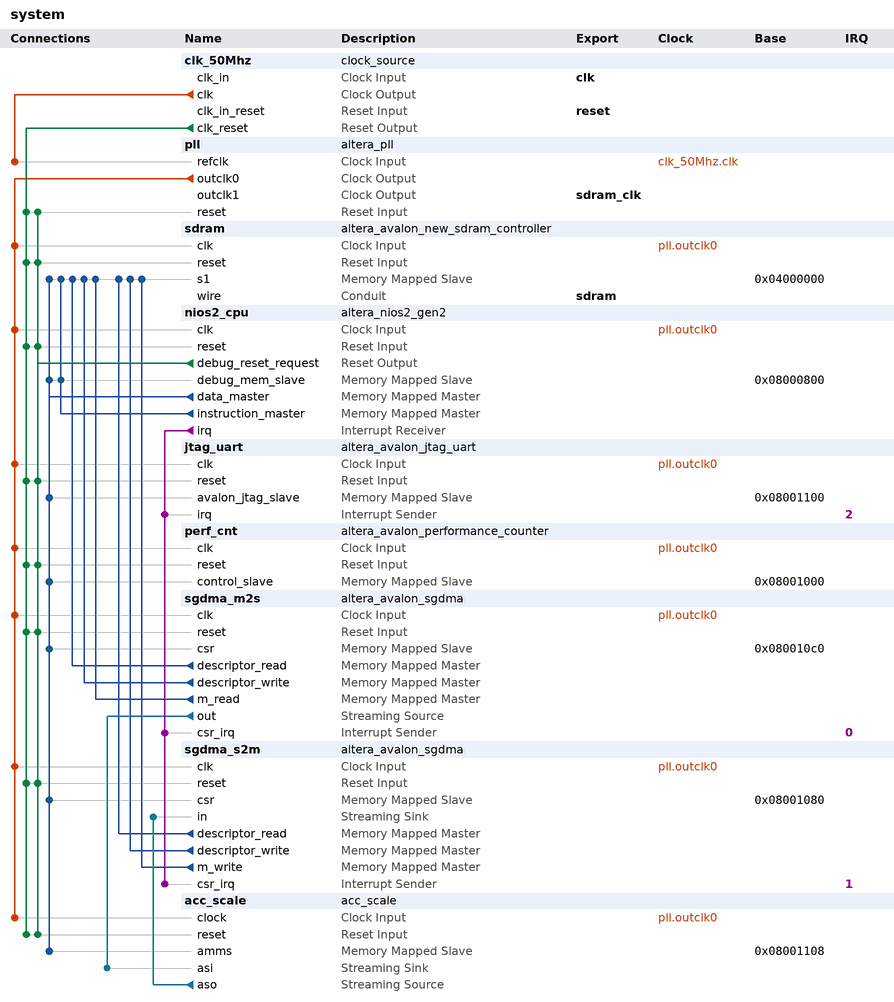
[diagram p0: system contents]
# Platform Designer (Qsys) system system, Cyclone V 5CSXFC6D6F31C6
# Parameters at their usual value, and those the tool derives, are not listed.
package require -exact qsys 18.1
create_system system
set_project_property DEVICE_FAMILY {Cyclone V}
set_project_property DEVICE 5CSXFC6D6F31C6

add_instance clk_50Mhz clock_source 18.1
set_instance_parameter_value clk_50Mhz clockFrequency 50000000

add_instance pll altera_pll 18.1
set_instance_parameter_value pll gui_device_speed_grade 1
set_instance_parameter_value pll gui_number_of_clocks 2
set_instance_parameter_value pll gui_operation_mode direct
set_instance_parameter_value pll gui_output_clock_frequency0 100.0
set_instance_parameter_value pll gui_output_clock_frequency1 100.0
set_instance_parameter_value pll gui_phase_shift1 -3000
set_instance_parameter_value pll gui_pll_mode {Integer-N PLL}
set_instance_parameter_value pll gui_reference_clock_frequency 50.0
set_instance_parameter_value pll gui_use_locked false

add_instance sdram altera_avalon_new_sdram_controller 18.1
set_instance_parameter_value sdram TAC 5.4
set_instance_parameter_value sdram TRCD 15.0
set_instance_parameter_value sdram TRFC 60.0
set_instance_parameter_value sdram TRP 15.0
set_instance_parameter_value sdram casLatency 2
set_instance_parameter_value sdram columnWidth 10
set_instance_parameter_value sdram dataWidth 16
set_instance_parameter_value sdram generateSimulationModel false
set_instance_parameter_value sdram initRefreshCommands 8
set_instance_parameter_value sdram model single_Micron_MT48LC4M32B2_7_chip
set_instance_parameter_value sdram numberOfBanks 4
set_instance_parameter_value sdram numberOfChipSelects 1
set_instance_parameter_value sdram powerUpDelay 100.0
set_instance_parameter_value sdram refreshPeriod 7.8125
set_instance_parameter_value sdram rowWidth 13

add_instance nios2_cpu altera_nios2_gen2 18.1
set_instance_parameter_value nios2_cpu dcache_size 2048
set_instance_parameter_value nios2_cpu exceptionSlave sdram.s1
set_instance_parameter_value nios2_cpu icache_size 4096
set_instance_parameter_value nios2_cpu impl Tiny
set_instance_parameter_value nios2_cpu resetSlave sdram.s1

add_instance jtag_uart altera_avalon_jtag_uart 18.1
set_instance_parameter_value jtag_uart simInteractiveOptions NO_INTERACTIVE_WINDOWS

add_instance perf_cnt altera_avalon_performance_counter 18.1
set_instance_parameter_value perf_cnt numberOfSections 7

add_instance sgdma_m2s altera_avalon_sgdma 18.1
set_instance_parameter_value sgdma_m2s enableBurstTransfers false
set_instance_parameter_value sgdma_m2s enableUnalignedTransfers false
set_instance_parameter_value sgdma_m2s readBlockDataWidth 8
set_instance_parameter_value sgdma_m2s sinkErrorWidth 0
set_instance_parameter_value sgdma_m2s sourceErrorWidth 0
set_instance_parameter_value sgdma_m2s transferMode MEMORY_TO_STREAM
set_instance_parameter_value sgdma_m2s writeBurstcountWidth 4

add_instance sgdma_s2m altera_avalon_sgdma 18.1
set_instance_parameter_value sgdma_s2m enableBurstTransfers false
set_instance_parameter_value sgdma_s2m enableUnalignedTransfers false
set_instance_parameter_value sgdma_s2m readBlockDataWidth 8
set_instance_parameter_value sgdma_s2m sinkErrorWidth 0
set_instance_parameter_value sgdma_s2m sourceErrorWidth 0
set_instance_parameter_value sgdma_s2m transferMode STREAM_TO_MEMORY
set_instance_parameter_value sgdma_s2m writeBurstcountWidth 4

add_instance acc_scale acc_scale 1.0
set_instance_parameter_value acc_scale max_width 1024

# connections
add_connection clk_50Mhz.clk pll.refclk clock
add_connection pll.outclk0 acc_scale.clock clock
add_connection pll.outclk0 jtag_uart.clk clock
add_connection pll.outclk0 nios2_cpu.clk clock
add_connection pll.outclk0 perf_cnt.clk clock
add_connection pll.outclk0 sdram.clk clock
add_connection pll.outclk0 sgdma_m2s.clk clock
add_connection pll.outclk0 sgdma_s2m.clk clock
add_connection clk_50Mhz.clk_reset acc_scale.reset reset
add_connection clk_50Mhz.clk_reset jtag_uart.reset reset
add_connection clk_50Mhz.clk_reset nios2_cpu.reset reset
add_connection clk_50Mhz.clk_reset perf_cnt.reset reset
add_connection clk_50Mhz.clk_reset pll.reset reset
add_connection clk_50Mhz.clk_reset sdram.reset reset
add_connection clk_50Mhz.clk_reset sgdma_m2s.reset reset
add_connection clk_50Mhz.clk_reset sgdma_s2m.reset reset
add_connection nios2_cpu.debug_reset_request acc_scale.reset reset
add_connection nios2_cpu.debug_reset_request jtag_uart.reset reset
add_connection nios2_cpu.debug_reset_request nios2_cpu.reset reset
add_connection nios2_cpu.debug_reset_request perf_cnt.reset reset
add_connection nios2_cpu.debug_reset_request pll.reset reset
add_connection nios2_cpu.debug_reset_request sdram.reset reset
add_connection nios2_cpu.debug_reset_request sgdma_m2s.reset reset
add_connection nios2_cpu.debug_reset_request sgdma_s2m.reset reset
add_connection nios2_cpu.data_master acc_scale.amms avalon
set_connection_parameter_value nios2_cpu.data_master/acc_scale.amms baseAddress 0x08001108
add_connection nios2_cpu.data_master jtag_uart.avalon_jtag_slave avalon
set_connection_parameter_value nios2_cpu.data_master/jtag_uart.avalon_jtag_slave baseAddress 0x08001100
add_connection nios2_cpu.data_master nios2_cpu.debug_mem_slave avalon
set_connection_parameter_value nios2_cpu.data_master/nios2_cpu.debug_mem_slave baseAddress 0x08000800
add_connection nios2_cpu.data_master perf_cnt.control_slave avalon
set_connection_parameter_value nios2_cpu.data_master/perf_cnt.control_slave baseAddress 0x08001000
add_connection nios2_cpu.data_master sdram.s1 avalon
set_connection_parameter_value nios2_cpu.data_master/sdram.s1 baseAddress 0x04000000
add_connection nios2_cpu.data_master sgdma_m2s.csr avalon
set_connection_parameter_value nios2_cpu.data_master/sgdma_m2s.csr baseAddress 0x080010c0
add_connection nios2_cpu.data_master sgdma_s2m.csr avalon
set_connection_parameter_value nios2_cpu.data_master/sgdma_s2m.csr baseAddress 0x08001080
add_connection nios2_cpu.instruction_master nios2_cpu.debug_mem_slave avalon
set_connection_parameter_value nios2_cpu.instruction_master/nios2_cpu.debug_mem_slave baseAddress 0x08000800
add_connection nios2_cpu.instruction_master sdram.s1 avalon
set_connection_parameter_value nios2_cpu.instruction_master/sdram.s1 baseAddress 0x04000000
add_connection sgdma_m2s.descriptor_read sdram.s1 avalon
set_connection_parameter_value sgdma_m2s.descriptor_read/sdram.s1 baseAddress 0x04000000
add_connection sgdma_m2s.descriptor_write sdram.s1 avalon
set_connection_parameter_value sgdma_m2s.descriptor_write/sdram.s1 baseAddress 0x04000000
add_connection sgdma_m2s.m_read sdram.s1 avalon
set_connection_parameter_value sgdma_m2s.m_read/sdram.s1 baseAddress 0x04000000
add_connection sgdma_s2m.descriptor_read sdram.s1 avalon
set_connection_parameter_value sgdma_s2m.descriptor_read/sdram.s1 baseAddress 0x04000000
add_connection sgdma_s2m.descriptor_write sdram.s1 avalon
set_connection_parameter_value sgdma_s2m.descriptor_write/sdram.s1 baseAddress 0x04000000
add_connection sgdma_s2m.m_write sdram.s1 avalon
set_connection_parameter_value sgdma_s2m.m_write/sdram.s1 baseAddress 0x04000000
add_connection acc_scale.aso sgdma_s2m.in avalon_streaming
add_connection sgdma_m2s.out acc_scale.asi avalon_streaming
add_connection nios2_cpu.irq jtag_uart.irq interrupt
set_connection_parameter_value nios2_cpu.irq/jtag_uart.irq irqNumber 2
add_connection nios2_cpu.irq sgdma_m2s.csr_irq interrupt
set_connection_parameter_value nios2_cpu.irq/sgdma_m2s.csr_irq irqNumber 0
add_connection nios2_cpu.irq sgdma_s2m.csr_irq interrupt
set_connection_parameter_value nios2_cpu.irq/sgdma_s2m.csr_irq irqNumber 1

# exported interfaces
add_interface clk clock sink
set_interface_property clk EXPORT_OF clk_50Mhz.clk_in
add_interface reset reset sink
set_interface_property reset EXPORT_OF clk_50Mhz.clk_in_reset
add_interface sdram conduit end
set_interface_property sdram EXPORT_OF sdram.wire
add_interface sdram_clk clock source
set_interface_property sdram_clk EXPORT_OF pll.outclk1

set_interconnect_requirement {$system} qsys_mm.clockCrossingAdapter HANDSHAKE
set_interconnect_requirement {$system} qsys_mm.enableEccProtection FALSE
set_interconnect_requirement {$system} qsys_mm.insertDefaultSlave FALSE
set_interconnect_requirement {$system} qsys_mm.maxAdditionalLatency 0

save_system system.qsys
